# EAGLE schematic schematic (EAGLE 7.7.0)
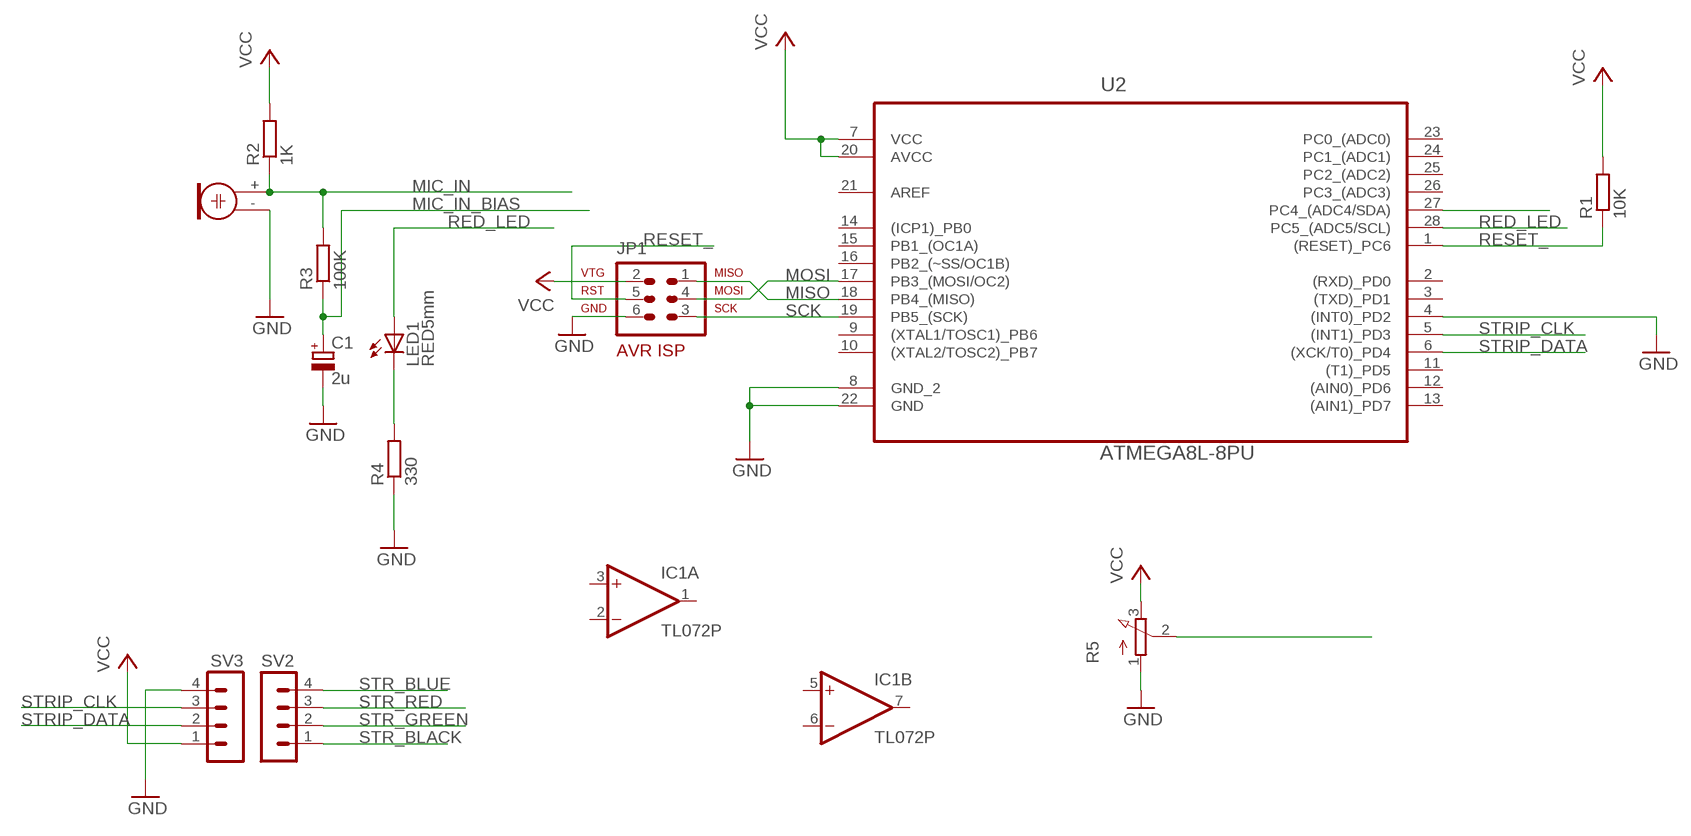
[diagram p0: schematic, sheet 1]

## Parts
C1  2u  CPOL-EUE2.5-5  [E2,5-5]
IC1  TL072P  [DIL08]
JP1  AVR-ISP-6  [AVR-ISP-6]
LED1  RED5mm  LED5MM  [LED5MM]
M1  ELECTRET_MICROPHON-TOM-1545P-R  [TOM-1545P-R]
R1  10K  R-EU_0207/10  [0207/10]
R2  1K  R-EU_0207/10  [0207/10]
R3  100K  R-EU_0207/10  [0207/10]
R4  330  R-EU_0207/10  [0207/10]
R5  3RP/1610N  [3RP/1610N]
SV2  MA04-1  [MA04-1]
SV3  MA04-1  [MA04-1]
U2  ATMEGA8L-8PU  [DIP254P762X457-28]

## Nets
GND: C1.- JP1.6 M1.- R4.1 R5.1(A) SV3.4 U2.4((INT0)_PD2) U2.8(GND_2) U2.22(GND)
MIC_IN: M1.+ R2.1 R3.2
MIC_IN_BIAS: C1.+ R3.1
MISO: JP1.1 U2.18(PB4_(MISO))
MOSI: JP1.4 U2.17(PB3_(MOSI/OC2))
N$1: LED1.K(C) R4.2
POT_OUT: R5.2(S) U2.27(PC4_(ADC4/SDA))
RED_LED: LED1.A U2.28(PC5_(ADC5/SCL))
RESET_: JP1.5 R1.1 U2.1((RESET)_PC6)
SCK: JP1.3 U2.19(PB5_(SCK))
STR_BLACK: SV2.1
STR_BLUE: SV2.4
STR_GREEN: SV2.2
STR_RED: SV2.3
STRIP_CLK: SV3.3 U2.5((INT1)_PD3)
STRIP_DATA: SV3.2 U2.6((XCK/T0)_PD4)
VCC: JP1.2 R1.2 R2.2 R5.3(E) SV3.1
XTAL2: U2.7(VCC) U2.20(AVCC)
Unconnected: IC1.1(A:OUT) IC1.2(A:-IN) IC1.3(A:+IN) IC1.5(B:+IN) IC1.6(B:-IN) IC1.7(B:OUT) U2.2((RXD)_PD0) U2.3((TXD)_PD1) U2.9((XTAL1/TOSC1)_PB6) U2.10((XTAL2/TOSC2)_PB7) U2.11((T1)_PD5) U2.12((AIN0)_PD6) U2.13((AIN1)_PD7) U2.14((ICP1)_PB0) U2.15(PB1_(OC1A)) U2.16(PB2_(~SS/OC1B)) U2.21(AREF) U2.23(PC0_(ADC0)) U2.24(PC1_(ADC1)) U2.25(PC2_(ADC2)) U2.26(PC3_(ADC3))

## Power pins joined to a net without a drawn wire
V+: IC1.8(P:V+)
V-: IC1.4(P:V-)

## Library data of the parts
C1 = rcl:CPOL-EU: POLARIZED CAPACITOR, European symbol
IC1 = linear:TL072: OP AMP
JP1 = avr-5:AVR-ISP-6: AVR ISP-6 Serial Programming Header
LED1 = led:LED: LED OSRAM: - CHIPLED LG R971, LG N971, LY N971, LG Q971, LY Q971, LO R971, LY R971 LH N974, LH R974 LS Q976, LO Q976, LY Q976 LO Q996 - Hyper CHIPLED LW Q18S LB Q993, LB Q99A, LB R99A - SideLED LS A670, LO A670, LY A670, LG A670, LP A670 LB A673, LV A673, LT A673, LW A673 LH A674 LY A675 LS A676, LA A676, LO A676, LY A676, LW A676 LS A679, LY A679, LG A679 - Hyper Micro SIDELED® LS Y876, LA Y876, LO Y876, LY Y876 LT Y87S - SmartLED LW L88C, LW L88S LB L89C, LB L89S, LG L890 LS L89K, LO L89K, LY L89K LS L896, LA L896, LO L896, LY L896 - TOPLED LS T670, LO T670, LY T670, LG T670, LP T670 LSG T670, LSP T670, LSY T670, LOP T670, LYG T670 LG T671, LOG T671, LSG T671 LB T673, LV T673, LT T673, LW T673 LH T674 LS T676, LA T676, LO T676, LY T676, LB T676, LH T676, LSB T676, LW T676 LB T67C, LV T67C, LT T67C, LS T67K, LO T67K, LY T67K, LW E67C LS E67B, LA E67B, LO E67B, LY E67B, LB E67C, LV E67C, LT E67C LW T67C LS T679, LY T679, LG T679 LS T770, LO T770, LY T770, LG T770, LP T770 LB T773, LV T773, LT T773, LW T773 LH T774 LS E675, LA E675, LY E675, LS T675 LS T776, LA T776, LO T776, LY T776, LB T776 LHGB T686 LT T68C, LB T68C - Hyper Mini TOPLED® LB M676 - Mini TOPLED Santana® LG M470 LS M47K, LO M47K, LY M47K Source: http://www.osram.convergy.de LUXEON: - LUMILED® LXK2-PW12-R00, LXK2-PW12-S00, LXK2-PW14-U00, LXK2-PW14-V00 LXK2-PM12-R00, LXK2-PM12-S00, LXK2-PM14-U00 LXK2-PE12-Q00, LXK2-PE12-R00, LXK2-PE12-S00, LXK2-PE14-T00, LXK2-PE14-U00 LXK2-PB12-K00, LXK2-PB12-L00, LXK2-PB12-M00, LXK2-PB14-N00, LXK2-PB14-P00, LXK2-PB14-Q00 LXK2-PR12-L00, LXK2-PR12-M00, LXK2-PR14-Q00, LXK2-PR14-R00 LXK2-PD12-Q00, LXK2-PD12-R00, LXK2-PD12-S00 LXK2-PH12-R00, LXK2-PH12-S00 LXK2-PL12-P00, LXK2-PL12-Q00, LXK2-PL12-R00 Source: www.luxeon.com KINGBRIGHT: KA-3528ASYC Source: www.kingbright.com
M1 = microphon:ELECTRET_MICROPHON-: Electret Condenser Microphone
R1-R4 = resistor:R-EU_: RESISTOR, European symbol
R5 = pot:3RP/1610N: 16mm Potentiometer one level Source: http://www.alphapotentiometers.net/html/16mm_pot_2.html
SV2 SV3 = con-lstb:MA04-1: PIN HEADER; OC_FARNELL: unknown; OC_NEWARK: unknown
U2 = Atmel_By_element14_Batch_1-00:ATMEGA8L-8PU: 8-bit with 8KBytes In-System Programmable Flash; DESCRIPTION: 8-bit with 8KBytes In-System Programmable Flash; MPN: ATMEGA8L-8PU; OC_FARNELL: 9171533; OC_NEWARK: 01M6903; PACKAGE: PCDIP-28; SUPPLIER: ATMEL